# Altium schematic sheet 08_QSPI_64Mbit_Flash_Memory.SchDoc
size 420 x 297 mm; Author: Shpakov Dmitry; Address1: Address1; Address2: Address2; Address3: Address3; Address4: Address4; DocumentNumber: АБВГ.123456.001 Э3; SheetNumber: 9; SheetTotal: 13; Scale: 1:1; DocumentType: Схема электрическая принципиальная; FirstReferrence: АБВГ.123456.001
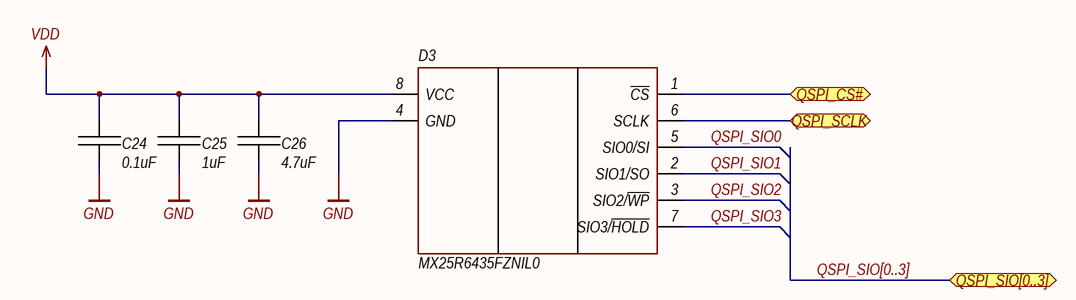
[diagram p0: 08_QSPI_64Mbit_Flash_Memory.SchDoc]

## Parts
C24  0.1uF  [CAPC1608X09N]
C25  1uF  [CAPC1608X09N]
C26  4.7uF  [CAPC1608X09N]
D3  MX25R6435FZNIL0  [SON127P600X80_HS-9N]

## Ports
QSPI_CS#, QSPI_SCLK, QSPI_SIO[0..3]

## Nets
GND: C24.1 C25.2 C26.1 D3.0(EPAD) D3.4(GND)
VDD: C24.2 C25.1 C26.2 D3.8(VCC)
QSPI_CS#: D3.1(~{CS}) ; port QSPI_CS#
QSPI_SCLK: D3.6(SCLK) ; port QSPI_SCLK
QSPI_SIO0: D3.5(SIO0/SI)
QSPI_SIO1: D3.2(SIO1/SO)
QSPI_SIO2: D3.3(SIO2/~{WP})
QSPI_SIO3: D3.7(SIO3/~{HOLD})

## Buses and harness runs
bus QSPI_SIO[0..3] = port QSPI_SIO[0..3]

## Notes on the sheet
- Author
- Manufacturer
- Date
- Page
- Total pages
- Size page
- A3
- Materials

## Library data of the parts
C24 = Ceramic: Ceramic capacitor; Manufacturer: Würth Elektronik; PartNumber: 885012206071; Power/Voltage: 25V; Tolerance: 10%; Operation Temperature: -55...+125; Help URL: https://www.digikey.com/en/products/detail/w%C3%BCrth-elektronik/885012206071/5453844; Type: capacitor; Value: 0.1uF; Note: *; Case: 0603
C25 = Ceramic: Ceramic capacitor; Manufacturer: Würth Elektronik; PartNumber: 885012106010; Power/Voltage: 10V; Tolerance: 20%; Operation Temperature: -55...+85; Help URL: https://www.digikey.com/en/products/detail/w%C3%BCrth-elektronik/885012106010/5453762; Type: capacitor; Value: 1uF; Note: *; Case: 0603
C26 = Ceramic: Ceramic capacitor; Manufacturer: Würth Elektronik; PartNumber: 885012106005; Power/Voltage: 6.3V; Tolerance: 20%; Operation Temperature: -55...+85; Help URL: https://www.digikey.com/en/products/detail/w%C3%BCrth-elektronik/885012106005/5453757; Type: capacitor; Value: 4.7uF; Note: *; Case: 0603
D3 = MX25R6435FZNIL0: FLASH - NOR Memory IC 64Mb (8M x 8) SPI - Quad I/O 8-WSON (6x5); Manufacturer: Macronix; Power/Voltage: 1.65V ~ 3.6V; Operation Temperature: -40...+85; Help URL: https://www.digikey.com/en/products/detail/macronix/MX25R6435FZNIL0/6558605?s=N4IgTCBcDaILIA0wFYBKA2ALAZmQMQC0A5ASQBkAGEAXQF8g; Type: FLASH - NOR; Value: *; Tolerance: *; Note: *; Case: 8-WSON (6x5); PartNumber: MX25R6435FZNIL0